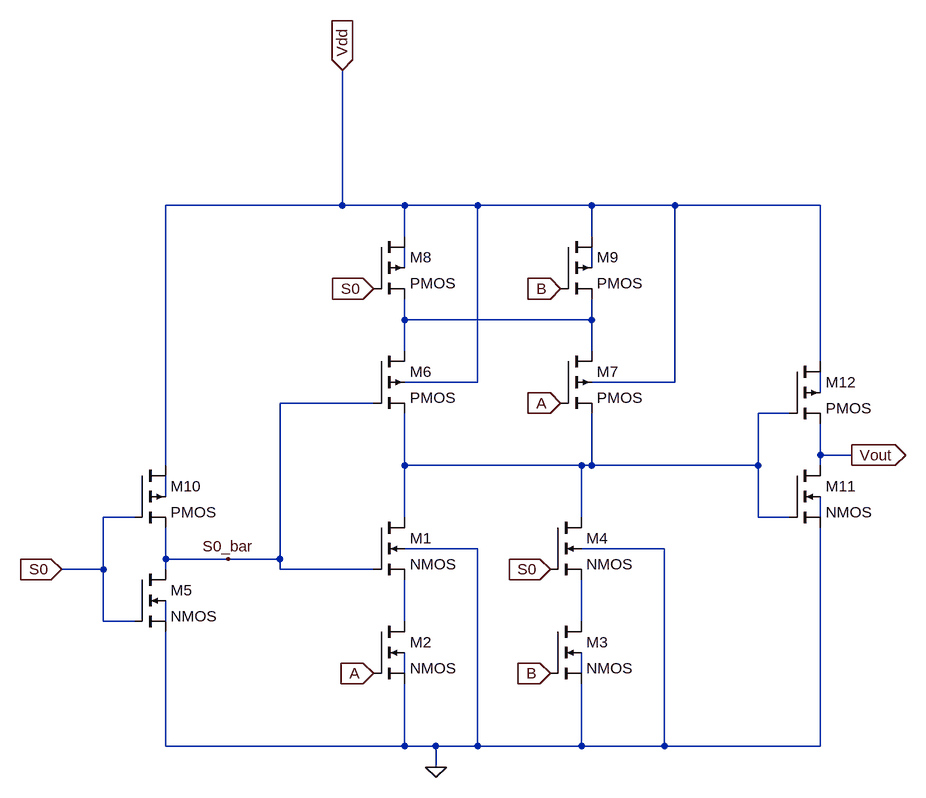
[diagram p0: schematic mux.asc]
mux.asc, the LTspice schematic file:
Version 4.1
SHEET 1 1712 728
WIRE 816 -176 816 -384
WIRE 816 -176 544 -176
WIRE 912 -176 816 -176
WIRE 1024 -176 912 -176
WIRE 1200 -176 1024 -176
WIRE 1328 -176 1200 -176
WIRE 1552 -176 1328 -176
WIRE 912 -128 912 -176
WIRE 1200 -128 1200 -176
WIRE 912 -80 912 -112
WIRE 1200 -80 1200 -112
WIRE 912 0 912 -32
WIRE 1200 0 1200 -32
WIRE 1200 0 912 0
WIRE 912 48 912 0
WIRE 1200 48 1200 0
WIRE 1552 64 1552 -176
WIRE 1024 96 1024 -176
WIRE 1024 96 912 96
WIRE 1328 96 1328 -176
WIRE 1328 96 1200 96
WIRE 1552 112 1552 80
WIRE 864 128 720 128
WIRE 1504 144 1456 144
WIRE 1552 208 1552 160
WIRE 1600 208 1552 208
WIRE 544 224 544 -176
WIRE 912 224 912 144
WIRE 1184 224 912 224
WIRE 1200 224 1200 144
WIRE 1200 224 1184 224
WIRE 1456 224 1456 144
WIRE 1456 224 1200 224
WIRE 1552 224 1552 208
WIRE 544 272 544 240
WIRE 496 304 448 304
WIRE 912 304 912 224
WIRE 1184 304 1184 224
WIRE 1456 304 1456 224
WIRE 1504 304 1456 304
WIRE 1552 304 1552 272
WIRE 1024 352 912 352
WIRE 1312 352 1184 352
WIRE 544 368 544 320
WIRE 640 368 544 368
WIRE 720 368 720 128
WIRE 720 368 640 368
WIRE 448 384 448 304
WIRE 448 384 384 384
WIRE 544 384 544 368
WIRE 720 384 720 368
WIRE 864 384 720 384
WIRE 448 464 448 384
WIRE 496 464 448 464
WIRE 544 464 544 432
WIRE 912 464 912 400
WIRE 1184 464 1184 400
WIRE 912 544 912 512
WIRE 1184 544 1184 512
WIRE 544 656 544 480
WIRE 912 656 912 560
WIRE 912 656 544 656
WIRE 960 656 912 656
WIRE 1024 656 1024 352
WIRE 1024 656 960 656
WIRE 1184 656 1184 560
WIRE 1184 656 1024 656
WIRE 1312 656 1312 352
WIRE 1312 656 1184 656
WIRE 1552 656 1552 320
WIRE 1552 656 1312 656
WIRE 960 688 960 656
FLAG 1152 128 A
IOPIN 1152 128 In
FLAG 864 544 A
IOPIN 864 544 In
FLAG 1136 544 B
IOPIN 1136 544 In
FLAG 1152 -48 B
IOPIN 1152 -48 In
FLAG 384 384 S0
IOPIN 384 384 In
FLAG 864 -48 S0
IOPIN 864 -48 In
FLAG 1136 384 S0
IOPIN 1136 384 In
FLAG 960 688 0
FLAG 1600 208 Vout
IOPIN 1600 208 Out
FLAG 816 -384 Vdd
IOPIN 816 -384 In
FLAG 640 368 S0_bar
SYMBOL nmos4 864 304 R0
SYMATTR InstName M1
SYMATTR Value2 l=180n w=800n
SYMBOL nmos4 864 464 R0
SYMATTR InstName M2
SYMATTR Value2 l=180n w=800n
SYMBOL nmos4 1136 464 R0
SYMATTR InstName M3
SYMATTR Value2 l=180n w=800n
SYMBOL nmos4 1136 304 R0
SYMATTR InstName M4
SYMATTR Value2 l=180n w=800n
SYMBOL nmos4 496 384 R0
SYMATTR InstName M5
SYMATTR Value2 l=180n w=400n
SYMBOL pmos4 864 48 R0
SYMATTR InstName M6
SYMATTR Value2 l=180n w=1600n
SYMBOL pmos4 1152 48 R0
SYMATTR InstName M7
SYMATTR Value2 l=180n w=1600n
SYMBOL pmos4 864 -128 R0
SYMATTR InstName M8
SYMATTR Value2 l=180n w=1600n
SYMBOL pmos4 1152 -128 R0
SYMATTR InstName M9
SYMATTR Value2 l=180n w=1600n
SYMBOL pmos4 496 224 R0
SYMATTR InstName M10
SYMATTR Value2 l=180n w=800n
SYMBOL nmos4 1504 224 R0
SYMATTR InstName M11
SYMATTR Value2 l=180n w=400n
SYMBOL pmos4 1504 64 R0
SYMATTR InstName M12
SYMATTR Value2 l=180n w=800n

The netlist it stands for:
* mux.asc
M1 N005 S0_bar N009 0 NMOS l=180n w=800n
M2 N009 A 0 N011 NMOS l=180n w=800n
M3 N010 B 0 N012 NMOS l=180n w=800n
M4 N005 S0 N010 0 NMOS l=180n w=800n
M5 S0_bar S0 0 N008 NMOS l=180n w=400n
M6 N003 S0_bar N005 Vdd PMOS l=180n w=1600n
M7 N003 A N005 Vdd PMOS l=180n w=1600n
M8 Vdd S0 N003 N001 PMOS l=180n w=1600n
M9 Vdd B N003 N002 PMOS l=180n w=1600n
M10 Vdd S0 S0_bar N006 PMOS l=180n w=800n
M11 Vout N005 0 N007 NMOS l=180n w=400n
M12 Vdd N005 Vout N004 PMOS l=180n w=800n
.model NMOS NMOS
.model PMOS PMOS
.lib standard.mos
.backanno
.end